# EasyEDA Pro project bitTree-Schem_2024-10-30.epro

# Schematic Top
Board Name: Board1; Create Date: 2024-10-25; Page Name: Top; Project Name: BitTree; Schematic Name: Top; Update Date: 2025-02-03; Company: bitaggregat.de; Drawn: TR; Page Size: A4; Reviewed: TR; Version: V1.0
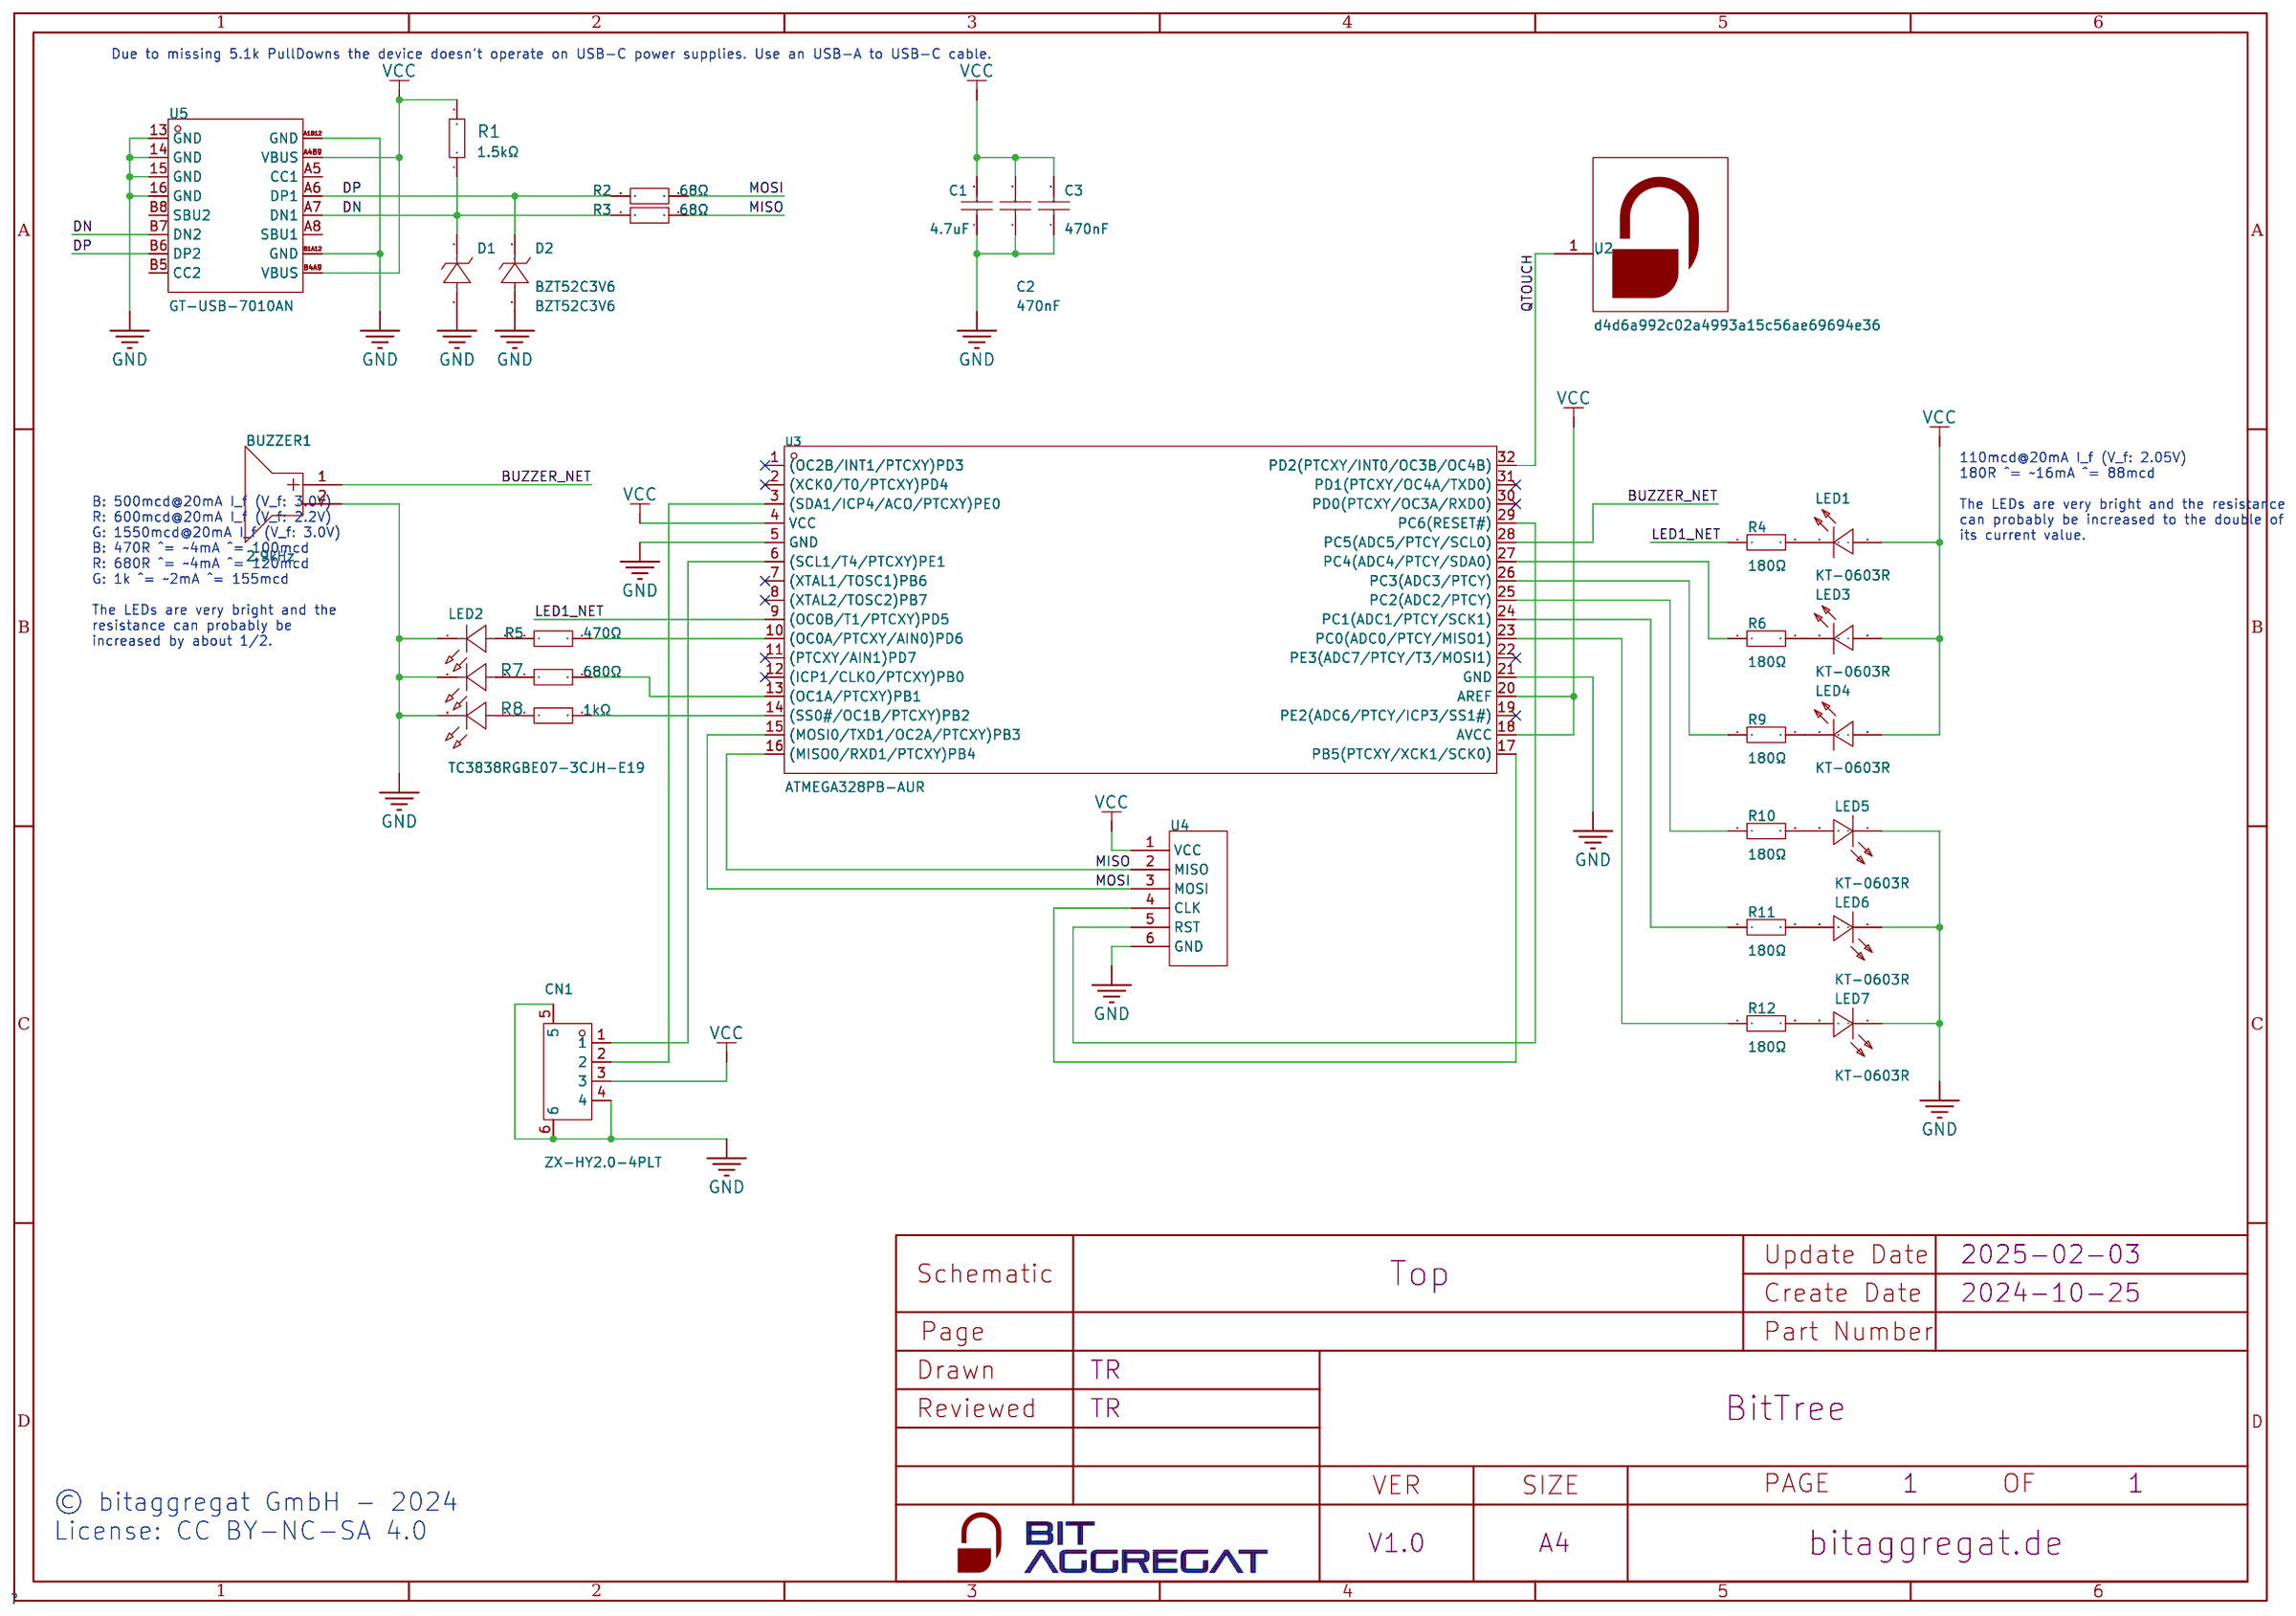
[diagram p0: schematic sheet]

## Parts
BUZZER1  2.9kHz  [BUZ-TH_BD9.0-P5.00-D0.6-L-FD]
C1  4.7uF  [C0603]
C2  470nF  [C0603]
C3  470nF  [C0603]
CN1  ZX-HY2.0-4PLT  [CONN-SMD_4P-P2.00_HY2.0-4P]
D1  BZT52C3V6  [SOD-123_L2.7-W1.6-LS3.7-RD]
D2  BZT52C3V6  [SOD-123_L2.7-W1.6-LS3.7-RD]
LED1  KT-0603R  [LED0603-RD]
LED2  TC3838RGBE07-3CJH-E19  [LED-SMD_6P-L3.5-W3.5-BL]
LED3  KT-0603R  [LED0603-RD]
LED4  KT-0603R  [LED0603-RD]
LED5  KT-0603R  [LED0603-RD]
LED6  KT-0603R  [LED0603-RD]
LED7  KT-0603R  [LED0603-RD]
R1  1.5kΩ  [R0603]
R2  68Ω  [R0603]
R3  68Ω  [R0603]
R4  180Ω  [R0603]
R5  470Ω  [R0603]
R6  180Ω  [R0603]
R7  680Ω  [R0603]
R8  1kΩ  [R0603]
R9  180Ω  [R0603]
R10  180Ω  [R0603]
R11  180Ω  [R0603]
R12  180Ω  [R0603]
U2  d4d6a992c02a4993a15c56ae69694e36  [QTouch-BA]  (no BOM)
U3  ATMEGA328PB-AUR  [TQFP-32_L7.0-W7.0-P0.80-LS9.0-BL]
U4  -  [ProgrammingHeader]  (no BOM)
U5  GT-USB-7010AN  [USB-SMD_GT-USB-7010AN]

## Library data of the parts
BUZZER1 = Cy-9055-5029: Oscillator Circuit:有源(内含驱动线路) Technology Type:电磁式 Operating Voltage:4V~7V Operating Voltage:4V~7V Frequency:2.9kHz Sound Pressure Level (SPL):85dB@5V,10cm Diameter (φD):9mm Height:6mm; LCSC Part Name: 电磁式有源蜂鸣器; Supplier Part: C200211; Manufacturer: CY(超音); Supplier Footprint: 插件,D=9mm; JLCPCB Part Class: Extended Part; Datasheet: https://atta.szlcsc.com/upload/public/pdf/source/20180420/C200211_A81316451996AD52A4D9A06CCBA2DFC8.pdf; Supplier: LCSC; Oscillator Circuit: 有源(内含驱动线路); Technology Type: 电磁式; Operating Voltage: 4V~7V; Sound Pressure Level (SPL): 85dB@5V,10cm; Diameter (φD): 9mm; Height: 6mm
C1 = CL10A475KO8NNNC: Capacitance: Tolerance:±10% Tolerance:±10% Voltage Rated: Temperature Coefficient:; LCSC Part Name: 4.7uF ±10% 16V; Supplier Part: C19666; Manufacturer: SAMSUNG(三星); Supplier Footprint: 0603; JLCPCB Part Class: Basic Part; Datasheet: https://atta.szlcsc.com/upload/public/pdf/source/20160218/1457707763339.pdf; Supplier: LCSC; Tolerance: ±10%
C2 C3 = CL10B474KA8NNNC: Capacitance: Tolerance:±10% Tolerance:±10% Voltage Rated: Temperature Coefficient:; LCSC Part Name: 470nF ±10% 25V; Supplier Part: C1623; Manufacturer: SAMSUNG(三星); Supplier Footprint: 0603; JLCPCB Part Class: Basic Part; Datasheet: https://atta.szlcsc.com/upload/public/pdf/source/20160218/1457707763339.pdf; Supplier: LCSC; Tolerance: ±10%
CN1 = ZX-HY2.0-4PLT: Pins Structure:1x4P Pitch:2mm Mounting Style:Brick nogging Reference Series:HY Number of Pins:4P Number of Rows:1 Number of PINs Per Row:4 Row Spacing:- Current Rating (Max):2A Contact Material:Brass Contact Plating:Tin Operating Temperature Range:-25℃~+8; LCSC Part Name: 1x4P 间距:2mm 立贴 系列:HY; Supplier Part: C7429562; Manufacturer: Megastar(兆星); Supplier Footprint: SMD,P=2mm; JLCPCB Part Class: Extended Part; Datasheet: https://atta.szlcsc.com/upload/public/pdf/source/20230619/75DC1B32EA4A989A042D3CF9348F58C8.pdf; Supplier: LCSC; Pins Structure: 1x4P; Pitch: 2mm; Mounting Style: Brick nogging; Reference Series: HY; Number of Pins: 4P; Number of Rows: 1; Number of PINs Per Row: 4; Current Rating (Max): 2A; Contact Material: Brass; Contact Plating: Tin; Operating Temperature Range: -25℃~+85℃
D1 D2 = BZT52C3V6_C19077397: Diode Configuration:Independent Type Zener Voltage (Nom):3.6V Reverse Leakage Current (Ir):5uA@1V Zener Voltage (Range):3.42V~3.78V Zener Voltage (Range):3.42V~3.78V Power Dissipation:500mW Zener Impedance (Zzt):90Ω; Supplier Part: C19077397; Manufacturer: 宏迦橙; Supplier Footprint: SOD-123; JLCPCB Part Class: Extended Part; Datasheet: https://atta.szlcsc.com/upload/public/pdf/source/20231117/6E01C14CCA1A38C68A5225952E4BCE14.pdf; Supplier: LCSC; Diode Configuration: Independent Type; Zener Voltage (Nom): 3.6V; Reverse Leakage Current (Ir): 5uA@1V; Zener Voltage (Range): 3.42V~3.78V; Power Dissipation: 500mW; Zener Impedance (Zzt): 90Ω
LED1 LED3-LED7 = KT-0603R: Emitted Color:Red Power Dissipation:- Forward Current:- Dominant Wavelength:- Dominant Wavelength:- Peak Wavelength:- Diode Configuration:- Lens Color:- Color Temperature:- Color Temperature:- Viewing Angle:- Mounting Sytle:- Operating Temperature:-40℃~+8; LCSC Part Name: 0603 红灯 高亮; Supplier Part: C2286; Manufacturer: KENTO; Supplier Footprint: 0603; JLCPCB Part Class: Basic Part; Datasheet: https://atta.szlcsc.com/upload/public/pdf/source/20160616/1466072038404.pdf; Supplier: LCSC; Emitted Color: Red; Operating Temperature: -40℃~+85℃
LED2 = TC3838RGBE07-3CJH-E19: LCSC Part Name: RGB三色; Supplier Part: C784547; Manufacturer: TCWIN(天成); Supplier Footprint: SMD3535; JLCPCB Part Class: Extended Part; Datasheet: https://atta.szlcsc.com/upload/public/pdf/source/20230731/32820CE5D5D80E19C372DEF700D68815.pdf; Supplier: LCSC
R1 = 0603WAF1501T5E: Type:Thick Film Resistors Resistance:1.5kΩ Tolerance:±1% Tolerance:±1% Power(Watts): Overload Voltage (Max): Temperature Coefficient:±100ppm/℃ Temperature Coefficient:±100ppm/℃ Operating Temperature Range:-55℃~+155℃ Operating Temperature Range:-55℃~+155℃; LCSC Part Name: 1.5kΩ ±1% 100mW 厚膜电阻; Supplier Part: C22843; Manufacturer: UNI-ROYAL(厚声); Supplier Footprint: 0603; JLCPCB Part Class: Basic Part; Datasheet: https://atta.szlcsc.com/upload/public/pdf/source/20200306/C422600_1E6D84923E4A46A82E41ADD87F860B5C.pdf; Supplier: LCSC; Type: Thick Film Resistors; Tolerance: ±1%; Temperature Coefficient: ±100ppm/℃; Operating Temperature Range: -55℃~+155℃
R2 R3 = 0603WAF680JT5E: Type:Thick Film Resistors Resistance:68Ω Tolerance:±1% Tolerance:±1% Power(Watts): Overload Voltage (Max): Temperature Coefficient:±100ppm/℃ Temperature Coefficient:±100ppm/℃ Operating Temperature Range:-55℃~+155℃ Operating Temperature Range:-55℃~+155℃; LCSC Part Name: 68Ω ±1% 100mW 厚膜电阻; Supplier Part: C27592; Manufacturer: UNI-ROYAL(厚声); Supplier Footprint: 0603; JLCPCB Part Class: Extended Part; Datasheet: https://atta.szlcsc.com/upload/public/pdf/source/20200306/C422600_1E6D84923E4A46A82E41ADD87F860B5C.pdf; Supplier: LCSC; Type: Thick Film Resistors; Tolerance: ±1%; Temperature Coefficient: ±100ppm/℃; Operating Temperature Range: -55℃~+155℃
R4 R6 R9-R12 = 0603WAF1800T5E: Type:Thick Film Resistors Resistance: Tolerance:±1% Tolerance:±1% Power(Watts): Overload Voltage (Max): Temperature Coefficient:±100ppm/℃ Temperature Coefficient:±100ppm/℃ Operating Temperature Range:-55℃~+155℃ Operating Temperature Range:-55℃~+155℃; LCSC Part Name: 180Ω ±1% 100mW 厚膜电阻; Supplier Part: C22828; Manufacturer: UNI-ROYAL(厚声); Supplier Footprint: 0603; JLCPCB Part Class: Extended Part; Datasheet: https://atta.szlcsc.com/upload/public/pdf/source/20200306/C422600_1E6D84923E4A46A82E41ADD87F860B5C.pdf; Supplier: LCSC; Type: Thick Film Resistors; Tolerance: ±1%; Temperature Coefficient: ±100ppm/℃; Operating Temperature Range: -55℃~+155℃
R5 = 0603WAF4700T5E: Type:Thick Film Resistors Resistance: Tolerance:±1% Tolerance:±1% Power(Watts): Overload Voltage (Max): Temperature Coefficient:±100ppm/℃ Temperature Coefficient:±100ppm/℃ Operating Temperature Range:-55℃~+155℃ Operating Temperature Range:-55℃~+155℃; LCSC Part Name: 470Ω ±1% 100mW 厚膜电阻; Supplier Part: C23179; Manufacturer: UNI-ROYAL(厚声); Supplier Footprint: 0603; JLCPCB Part Class: Basic Part; Datasheet: https://atta.szlcsc.com/upload/public/pdf/source/20200306/C422600_1E6D84923E4A46A82E41ADD87F860B5C.pdf; Supplier: LCSC; Type: Thick Film Resistors; Tolerance: ±1%; Temperature Coefficient: ±100ppm/℃; Operating Temperature Range: -55℃~+155℃
R7 = 0603WAF6800T5E: Type:Thick Film Resistors Resistance: Tolerance:±1% Tolerance:±1% Power(Watts): Overload Voltage (Max): Temperature Coefficient:±100ppm/℃ Temperature Coefficient:±100ppm/℃ Operating Temperature Range:-55℃~+155℃ Operating Temperature Range:-55℃~+155℃; LCSC Part Name: 680Ω ±1% 100mW 厚膜电阻; Supplier Part: C23228; Manufacturer: UNI-ROYAL(厚声); Supplier Footprint: 0603; JLCPCB Part Class: Basic Part; Datasheet: https://atta.szlcsc.com/upload/public/pdf/source/20200306/C422600_1E6D84923E4A46A82E41ADD87F860B5C.pdf; Supplier: LCSC; Type: Thick Film Resistors; Tolerance: ±1%; Temperature Coefficient: ±100ppm/℃; Operating Temperature Range: -55℃~+155℃
R8 = 0603WAF1001T5E: Type:Thick Film Resistors Resistance:1kΩ Tolerance:±1% Tolerance:±1% Power(Watts): Overload Voltage (Max): Temperature Coefficient:±100ppm/℃ Temperature Coefficient:±100ppm/℃ Operating Temperature Range:-55℃~+155℃ Operating Temperature Range:-55℃~+155℃; LCSC Part Name: 1kΩ ±1% 100mW 厚膜电阻; Supplier Part: C21190; Manufacturer: UNI-ROYAL(厚声); Supplier Footprint: 0603; JLCPCB Part Class: Basic Part; Datasheet: https://atta.szlcsc.com/upload/public/pdf/source/20200306/C422600_1E6D84923E4A46A82E41ADD87F860B5C.pdf; Supplier: LCSC; Type: Thick Film Resistors; Tolerance: ±1%; Temperature Coefficient: ±100ppm/℃; Operating Temperature Range: -55℃~+155℃
U2 = QTouch-BA
U3 = ATMEGA328PB-AUR: CPU Core:AVR Program Storage Size:32KB RAM Size:2KB GPIO Ports Number:27 Operating Voltage Range:1.8V~5.5V Operating Voltage Range:1.8V~5.5V CPU Maximum Speed:20MHz Program Memory Type:FLASH EEPROM:1KB Operating Temperature Range:-40℃~+85℃ Operating Tempe; Supplier Part: C461612; Manufacturer: MICROCHIP(美国微芯); Supplier Footprint: TQFP-32(7x7); JLCPCB Part Class: Extended Part; Datasheet: https://atta.szlcsc.com/upload/public/pdf/source/20180613/C194192_8D5429A154CB618E2C039489BC28712B.pdf; Supplier: LCSC; CPU Core: AVR; Program Storage Size: 32KB; RAM Size: 2KB; GPIO Ports Number: 27; Operating Voltage Range: 1.8V~5.5V; CPU Maximum Speed: 20MHz; Program Memory Type: FLASH; EEPROM: 1KB; Operating Temperature Range: -40℃~+85℃; ADC (Bit): 10bit; Peripheral/Function: PWM; Watchdog: 有; Low-Voltage Detect: 有; Internal Oscillator: 有
U4 = ProgrammingHeader
U5 = GT-USB-7010AN: Connector Type:Type-C Standard:USB 2.0 Gender:Female Mounting Style:卧贴 Number of Contacts:16P Number of Ports:1 Current Rating - Power (Max):5A Contact Material:高导铜 Contact Plating:Gold Operating Temperature Range:-40℃~+85℃ Operating Temperature Range:-40; LCSC Part Name: Type-C 母 卧贴 黑色; Supplier Part: C963370; Manufacturer: G-Switch(品赞); Supplier Footprint: SMD; JLCPCB Part Class: Extended Part; Datasheet: https://atta.szlcsc.com/upload/public/pdf/source/20231219/A53A193191E7DF39BB7DE19828A2E6A3.pdf; Supplier: LCSC; Connector Type: Type-C; Standard: USB 2.0; Gender: Female; Mounting Style: 卧贴; Number of Contacts: 16P; Number of Ports: 1; Current Rating - Power (Max): 5A; Contact Material: 高导铜; Contact Plating: Gold; Operating Temperature Range: -40℃~+85℃

## Nets
GND: BUZZER1.2(-) C1.1 C2.1 C3.1 CN1.4 CN1.5 CN1.6 D1.2(A) D2.2(A) LED2.4(-) LED2.5(-) LED2.6(-) LED5.1(K) LED6.1(K) LED7.1(K) U3.5(GND) U3.21(GND) U4.6(GND) U5.13(GND) U5.14(GND) U5.15(GND) U5.16(GND) U5.A1B12(GND) U5.B1A12(GND)
VCC: C1.2 C2.2 C3.2 CN1.3 LED1.2(A) LED3.2(A) LED4.2(A) R1.2 U3.4(VCC) U3.18(AVCC) U3.20(AREF) U4.1(VCC) U5.A4B9(VBUS) U5.B4A9(VBUS)
BUZZER_NET: BUZZER1.1(+) U3.28(PC5(ADC5/PTCY/SCL0))
DN: D1.1(K) R1.1 R3.1 U5.A7(DN1) U5.B7(DN2)
DP: D2.1(K) R2.1 U5.A6(DP1) U5.B6(DP2)
LED1_NET: R4.1 U3.9((OC0B/T1/PTCXY)PD5)
MISO: R3.2 U3.16((MISO0/RXD1/PTCXY)PB4) U4.2(MISO)
MOSI: R2.2 U3.15((MOSI0/TXD1/OC2A/PTCXY)PB3) U4.3(MOSI)
QTOUCH: U2.1 U3.32(PD2(PTCXY/INT0/OC3B/OC4B))
Net-(CN1-1): CN1.1 U3.6((SCL1/T4/PTCXY)PE1)
Net-(CN1-2): CN1.2 U3.3((SDA1/ICP4/ACO/PTCXY)PE0)
Net-(LED1-1): LED1.1(K) R4.2
Net-(LED2-1): LED2.1(+) R8.1
Net-(LED2-2): LED2.2(+) R7.1
Net-(LED2-3): LED2.3(+) R5.1
Net-(LED3-1): LED3.1(K) R6.2
Net-(LED4-1): LED4.1(K) R9.2
Net-(LED5-2): LED5.2(A) R10.2
Net-(LED6-2): LED6.2(A) R11.2
Net-(LED7-2): LED7.2(A) R12.2
Net-(R5-2): R5.2 U3.10((OC0A/PTCXY/AIN0)PD6)
Net-(R6-1): R6.1 U3.27(PC4(ADC4/PTCY/SDA0))
Net-(R7-2): R7.2 U3.13((OC1A/PTCXY)PB1)
Net-(R8-2): R8.2 U3.14((SS0#/OC1B/PTCXY)PB2)
Net-(R9-1): R9.1 U3.26(PC3(ADC3/PTCY))
Net-(R10-1): R10.1 U3.25(PC2(ADC2/PTCY))
Net-(R11-1): R11.1 U3.24(PC1(ADC1/PTCY/SCK1))
Net-(R12-1): R12.1 U3.23(PC0(ADC0/PTCY/MISO1))
Net-(U3-17): U3.17(PB5(PTCXY/XCK1/SCK0)) U4.4(CLK)
Net-(U3-29): U3.29(PC6(RESET#)) U4.5(RST)

Not connected (* = marked no-connect by the designer): U3 1((OC2B/INT1/PTCXY)PD3)* 2((XCK0/T0/PTCXY)PD4)* 7((XTAL1/TOSC1)PB6)* 8((XTAL2/TOSC2)PB7)* 11((PTCXY/AIN1)PD7)* 12((ICP1/CLKO/PTCXY)PB0)* 19(PE2(ADC6/PTCY/ICP3/SS1#))* 22(PE3(ADC7/PTCY/T3/MOSI1))* 30(PD0(PTCXY/OC3A/RXD0))* 31(PD1(PTCXY/OC4A/TXD0))*; U5 A5(CC1) A8(SBU1) B5(CC2) B8(SBU2)

## Notes on the sheet
- Due to missing 5.1k PullDowns the device doesn't operate on USB-C power supplies. Use an USB-A to USB-C cable.
- 110mcd@20mA I_f (V_f: 2.05V)
  180R ^= ~16mA ^= 88mcd
  The LEDs are very bright and the resistance
  can probably be increased to the double of
  its current value.
- B: 500mcd@20mA I_f (V_f: 3.0V)
  R: 600mcd@20mA I_f (V_f: 2.2V)
  G: 1550mcd@20mA I_f (V_f: 3.0V)
  B: 470R ^= ~4mA ^= 100mcd
  R: 680R ^= ~4mA ^= 120mcd
  G: 1k ^= ~2mA ^= 155mcd
  The LEDs are very bright and the
  resistance can probably be
  increased by about 1/2.
- © bitaggregat GmbH - 2024
  License: CC BY-NC-SA 4.0
